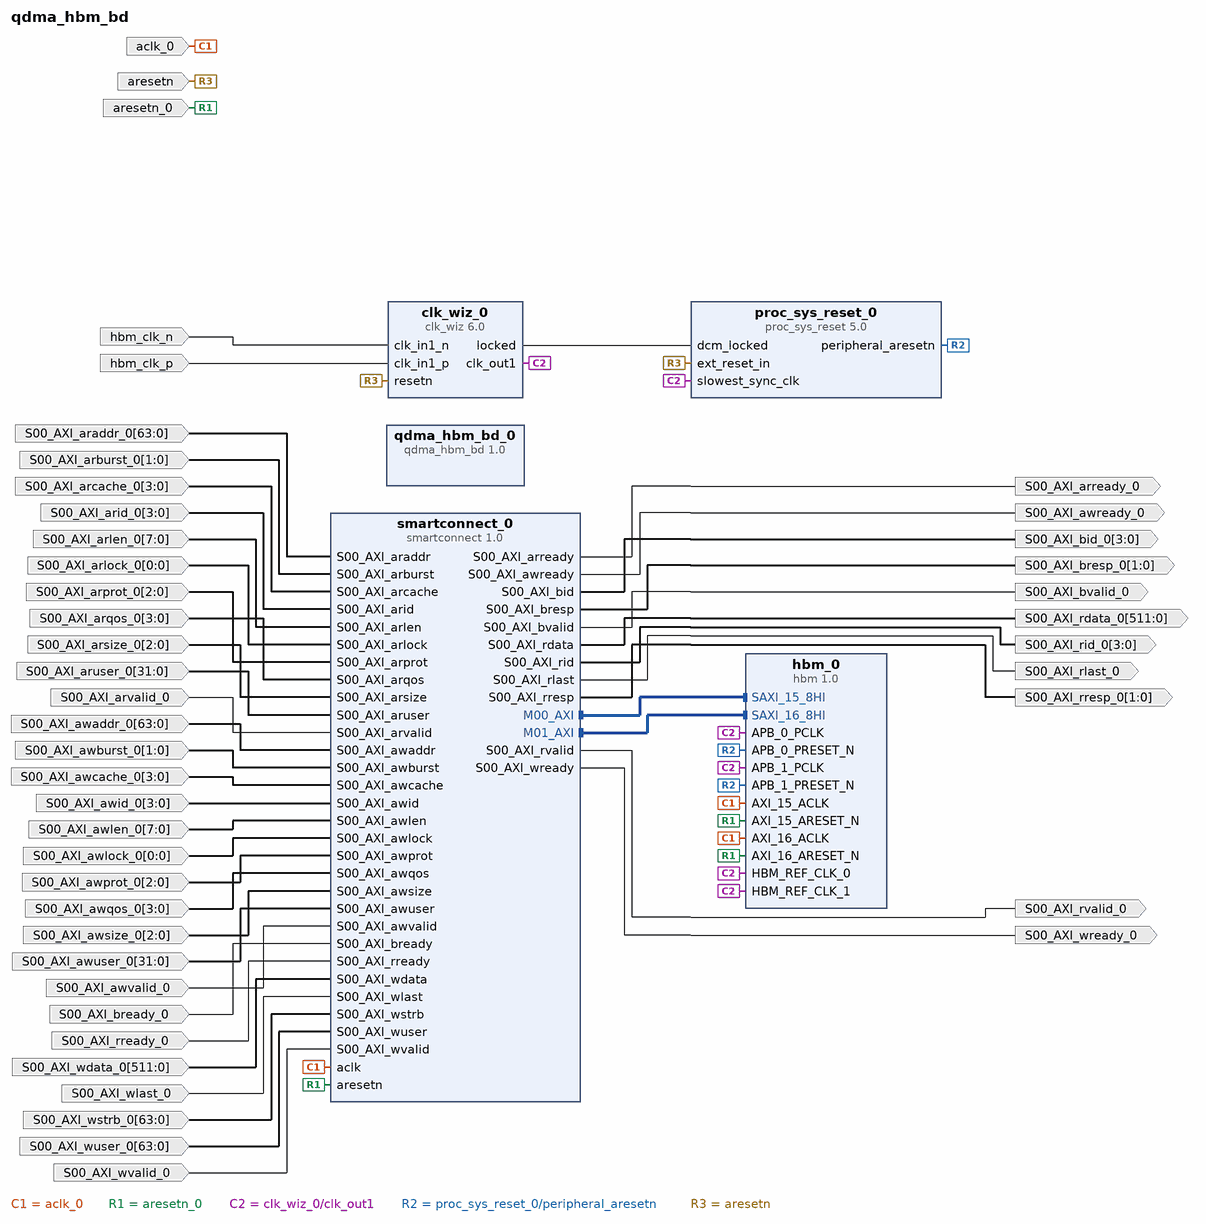
[diagram p0: block diagram of the top level]
# Vivado block design qdma_hbm_bd, xcu55c-fsvh2892-2L-e, Vivado 2024.2
create_bd_design qdma_hbm_bd

create_bd_port -dir I -type clk hbm_clk_n
set_property -dict {CONFIG.FREQ_HZ 100000000} [get_bd_ports hbm_clk_n]
create_bd_port -dir I -type clk hbm_clk_p
set_property -dict {CONFIG.FREQ_HZ 100000000} [get_bd_ports hbm_clk_p]
create_bd_port -dir I -type rst aresetn
create_bd_port -dir I -type clk aclk_0
set_property -dict {CONFIG.FREQ_HZ 250000000} [get_bd_ports aclk_0]
create_bd_port -dir I -type rst aresetn_0
create_bd_port -dir I -from 3 -to 0 S00_AXI_awid_0
create_bd_port -dir I -from 63 -to 0 S00_AXI_awaddr_0
create_bd_port -dir I -from 7 -to 0 S00_AXI_awlen_0
create_bd_port -dir I -from 2 -to 0 S00_AXI_awsize_0
create_bd_port -dir I -from 1 -to 0 S00_AXI_awburst_0
create_bd_port -dir I -from 0 -to 0 S00_AXI_awlock_0
create_bd_port -dir I -from 3 -to 0 S00_AXI_awcache_0
create_bd_port -dir I -from 2 -to 0 S00_AXI_awprot_0
create_bd_port -dir I -from 3 -to 0 S00_AXI_awqos_0
create_bd_port -dir I -from 31 -to 0 S00_AXI_awuser_0
create_bd_port -dir I S00_AXI_awvalid_0
create_bd_port -dir O S00_AXI_awready_0
create_bd_port -dir I -from 511 -to 0 S00_AXI_wdata_0
create_bd_port -dir I -from 63 -to 0 S00_AXI_wstrb_0
create_bd_port -dir I S00_AXI_wlast_0
create_bd_port -dir I -from 63 -to 0 S00_AXI_wuser_0
create_bd_port -dir I S00_AXI_wvalid_0
create_bd_port -dir O S00_AXI_wready_0
create_bd_port -dir O -from 3 -to 0 S00_AXI_bid_0
create_bd_port -dir O -from 1 -to 0 S00_AXI_bresp_0
create_bd_port -dir O S00_AXI_bvalid_0
create_bd_port -dir I S00_AXI_bready_0
create_bd_port -dir I -from 3 -to 0 S00_AXI_arid_0
create_bd_port -dir I -from 63 -to 0 S00_AXI_araddr_0
create_bd_port -dir I -from 7 -to 0 S00_AXI_arlen_0
create_bd_port -dir I -from 2 -to 0 S00_AXI_arsize_0
create_bd_port -dir I -from 1 -to 0 S00_AXI_arburst_0
create_bd_port -dir I -from 0 -to 0 S00_AXI_arlock_0
create_bd_port -dir I -from 3 -to 0 S00_AXI_arcache_0
create_bd_port -dir I -from 2 -to 0 S00_AXI_arprot_0
create_bd_port -dir I -from 3 -to 0 S00_AXI_arqos_0
create_bd_port -dir I -from 31 -to 0 S00_AXI_aruser_0
create_bd_port -dir I S00_AXI_arvalid_0
create_bd_port -dir O S00_AXI_arready_0
create_bd_port -dir O -from 3 -to 0 S00_AXI_rid_0
create_bd_port -dir O -from 511 -to 0 S00_AXI_rdata_0
create_bd_port -dir O -from 1 -to 0 S00_AXI_rresp_0
create_bd_port -dir O S00_AXI_rlast_0
create_bd_port -dir O S00_AXI_rvalid_0
create_bd_port -dir I S00_AXI_rready_0

create_bd_cell -type ip -vlnv xilinx.com:ip:hbm:1.0 hbm_0
set_property -dict [list \
  CONFIG.USER_APB_EN false \
  CONFIG.USER_AXI_INPUT_CLK1_FREQ 250 \
  CONFIG.USER_AXI_INPUT_CLK_FREQ 250 \
  CONFIG.USER_HBM_DENSITY 16GB \
  CONFIG.USER_MC0_USER_PARITY_EN false \
  CONFIG.USER_SAXI_00 false \
  CONFIG.USER_SAXI_01 false \
  CONFIG.USER_SAXI_02 false \
  CONFIG.USER_SAXI_03 false \
  CONFIG.USER_SAXI_04 false \
  CONFIG.USER_SAXI_05 false \
  CONFIG.USER_SAXI_06 false \
  CONFIG.USER_SAXI_07 false \
  CONFIG.USER_SAXI_08 false \
  CONFIG.USER_SAXI_09 false \
  CONFIG.USER_SAXI_10 false \
  CONFIG.USER_SAXI_11 false \
  CONFIG.USER_SAXI_12 false \
  CONFIG.USER_SAXI_13 false \
  CONFIG.USER_SAXI_14 false \
  CONFIG.USER_SAXI_17 false \
  CONFIG.USER_SAXI_18 false \
  CONFIG.USER_SAXI_19 false \
  CONFIG.USER_SAXI_20 false \
  CONFIG.USER_SAXI_21 false \
  CONFIG.USER_SAXI_22 false \
  CONFIG.USER_SAXI_23 false \
  CONFIG.USER_SAXI_24 false \
  CONFIG.USER_SAXI_25 false \
  CONFIG.USER_SAXI_26 false \
  CONFIG.USER_SAXI_27 false \
  CONFIG.USER_SAXI_28 false \
  CONFIG.USER_SAXI_29 false \
  CONFIG.USER_SAXI_30 false \
  CONFIG.USER_SAXI_31 false \
] [get_bd_cells hbm_0]
create_bd_cell -type ip -vlnv xilinx.com:ip:smartconnect:1.0 smartconnect_0
set_property -dict {CONFIG.NUM_MI 2 CONFIG.NUM_SI 1} [get_bd_cells smartconnect_0]
create_bd_cell -type ip -vlnv xilinx.com:ip:clk_wiz:6.0 clk_wiz_0
set_property -dict [list \
  CONFIG.PRIM_SOURCE Differential_clock_capable_pin \
  CONFIG.RESET_PORT resetn \
  CONFIG.RESET_TYPE ACTIVE_LOW \
] [get_bd_cells clk_wiz_0]
create_bd_cell -type ip -vlnv xilinx.com:ip:proc_sys_reset:5.0 proc_sys_reset_0
create_bd_cell -type ip -vlnv user.org:user:qdma_hbm_bd:1.0 qdma_hbm_bd_0

# ---- connections ----

connect_bd_intf_net [get_bd_intf_pins smartconnect_0/M00_AXI] [get_bd_intf_pins hbm_0/SAXI_15_8HI]
connect_bd_intf_net [get_bd_intf_pins smartconnect_0/M01_AXI] [get_bd_intf_pins hbm_0/SAXI_16_8HI]
connect_bd_net -net S00_AXI_araddr_0_1 [get_bd_ports S00_AXI_araddr_0] [get_bd_pins smartconnect_0/S00_AXI_araddr]
connect_bd_net -net S00_AXI_arburst_0_1 [get_bd_ports S00_AXI_arburst_0] [get_bd_pins smartconnect_0/S00_AXI_arburst]
connect_bd_net -net S00_AXI_arcache_0_1 [get_bd_ports S00_AXI_arcache_0] [get_bd_pins smartconnect_0/S00_AXI_arcache]
connect_bd_net -net S00_AXI_arid_0_1 [get_bd_ports S00_AXI_arid_0] [get_bd_pins smartconnect_0/S00_AXI_arid]
connect_bd_net -net S00_AXI_arlen_0_1 [get_bd_ports S00_AXI_arlen_0] [get_bd_pins smartconnect_0/S00_AXI_arlen]
connect_bd_net -net S00_AXI_arlock_0_1 [get_bd_ports S00_AXI_arlock_0] [get_bd_pins smartconnect_0/S00_AXI_arlock]
connect_bd_net -net S00_AXI_arprot_0_1 [get_bd_ports S00_AXI_arprot_0] [get_bd_pins smartconnect_0/S00_AXI_arprot]
connect_bd_net -net S00_AXI_arqos_0_1 [get_bd_ports S00_AXI_arqos_0] [get_bd_pins smartconnect_0/S00_AXI_arqos]
connect_bd_net -net S00_AXI_arsize_0_1 [get_bd_ports S00_AXI_arsize_0] [get_bd_pins smartconnect_0/S00_AXI_arsize]
connect_bd_net -net S00_AXI_aruser_0_1 [get_bd_ports S00_AXI_aruser_0] [get_bd_pins smartconnect_0/S00_AXI_aruser]
connect_bd_net -net S00_AXI_arvalid_0_1 [get_bd_ports S00_AXI_arvalid_0] [get_bd_pins smartconnect_0/S00_AXI_arvalid]
connect_bd_net -net S00_AXI_awaddr_0_1 [get_bd_ports S00_AXI_awaddr_0] [get_bd_pins smartconnect_0/S00_AXI_awaddr]
connect_bd_net -net S00_AXI_awburst_0_1 [get_bd_ports S00_AXI_awburst_0] [get_bd_pins smartconnect_0/S00_AXI_awburst]
connect_bd_net -net S00_AXI_awcache_0_1 [get_bd_ports S00_AXI_awcache_0] [get_bd_pins smartconnect_0/S00_AXI_awcache]
connect_bd_net -net S00_AXI_awid_0_1 [get_bd_ports S00_AXI_awid_0] [get_bd_pins smartconnect_0/S00_AXI_awid]
connect_bd_net -net S00_AXI_awlen_0_1 [get_bd_ports S00_AXI_awlen_0] [get_bd_pins smartconnect_0/S00_AXI_awlen]
connect_bd_net -net S00_AXI_awlock_0_1 [get_bd_ports S00_AXI_awlock_0] [get_bd_pins smartconnect_0/S00_AXI_awlock]
connect_bd_net -net S00_AXI_awprot_0_1 [get_bd_ports S00_AXI_awprot_0] [get_bd_pins smartconnect_0/S00_AXI_awprot]
connect_bd_net -net S00_AXI_awqos_0_1 [get_bd_ports S00_AXI_awqos_0] [get_bd_pins smartconnect_0/S00_AXI_awqos]
connect_bd_net -net S00_AXI_awsize_0_1 [get_bd_ports S00_AXI_awsize_0] [get_bd_pins smartconnect_0/S00_AXI_awsize]
connect_bd_net -net S00_AXI_awuser_0_1 [get_bd_ports S00_AXI_awuser_0] [get_bd_pins smartconnect_0/S00_AXI_awuser]
connect_bd_net -net S00_AXI_awvalid_0_1 [get_bd_ports S00_AXI_awvalid_0] [get_bd_pins smartconnect_0/S00_AXI_awvalid]
connect_bd_net -net S00_AXI_bready_0_1 [get_bd_ports S00_AXI_bready_0] [get_bd_pins smartconnect_0/S00_AXI_bready]
connect_bd_net -net S00_AXI_rready_0_1 [get_bd_ports S00_AXI_rready_0] [get_bd_pins smartconnect_0/S00_AXI_rready]
connect_bd_net -net S00_AXI_wdata_0_1 [get_bd_ports S00_AXI_wdata_0] [get_bd_pins smartconnect_0/S00_AXI_wdata]
connect_bd_net -net S00_AXI_wlast_0_1 [get_bd_ports S00_AXI_wlast_0] [get_bd_pins smartconnect_0/S00_AXI_wlast]
connect_bd_net -net S00_AXI_wstrb_0_1 [get_bd_ports S00_AXI_wstrb_0] [get_bd_pins smartconnect_0/S00_AXI_wstrb]
connect_bd_net -net S00_AXI_wuser_0_1 [get_bd_ports S00_AXI_wuser_0] [get_bd_pins smartconnect_0/S00_AXI_wuser]
connect_bd_net -net S00_AXI_wvalid_0_1 [get_bd_ports S00_AXI_wvalid_0] [get_bd_pins smartconnect_0/S00_AXI_wvalid]
connect_bd_net -net aclk_0_1 [get_bd_ports aclk_0] [get_bd_pins smartconnect_0/aclk] [get_bd_pins hbm_0/AXI_15_ACLK] [get_bd_pins hbm_0/AXI_16_ACLK]
connect_bd_net -net aclk_n_1 [get_bd_ports hbm_clk_n] [get_bd_pins clk_wiz_0/clk_in1_n]
connect_bd_net -net aclk_p_1 [get_bd_ports hbm_clk_p] [get_bd_pins clk_wiz_0/clk_in1_p]
connect_bd_net -net aresetn_0_1 [get_bd_ports aresetn_0] \
  [get_bd_pins smartconnect_0/aresetn] [get_bd_pins hbm_0/AXI_15_ARESET_N] [get_bd_pins hbm_0/AXI_16_ARESET_N]
connect_bd_net [get_bd_pins clk_wiz_0/clk_out1] \
  [get_bd_pins hbm_0/HBM_REF_CLK_0] [get_bd_pins hbm_0/HBM_REF_CLK_1] [get_bd_pins hbm_0/APB_0_PCLK] \
  [get_bd_pins hbm_0/APB_1_PCLK] [get_bd_pins proc_sys_reset_0/slowest_sync_clk]
connect_bd_net [get_bd_pins clk_wiz_0/locked] [get_bd_pins proc_sys_reset_0/dcm_locked]
connect_bd_net [get_bd_pins proc_sys_reset_0/peripheral_aresetn] [get_bd_pins hbm_0/APB_0_PRESET_N] [get_bd_pins hbm_0/APB_1_PRESET_N]
connect_bd_net -net resetn_0_1 [get_bd_ports aresetn] [get_bd_pins proc_sys_reset_0/ext_reset_in] [get_bd_pins clk_wiz_0/resetn]
connect_bd_net [get_bd_pins smartconnect_0/S00_AXI_arready] [get_bd_ports S00_AXI_arready_0]
connect_bd_net [get_bd_pins smartconnect_0/S00_AXI_awready] [get_bd_ports S00_AXI_awready_0]
connect_bd_net [get_bd_pins smartconnect_0/S00_AXI_bid] [get_bd_ports S00_AXI_bid_0]
connect_bd_net [get_bd_pins smartconnect_0/S00_AXI_bresp] [get_bd_ports S00_AXI_bresp_0]
connect_bd_net [get_bd_pins smartconnect_0/S00_AXI_bvalid] [get_bd_ports S00_AXI_bvalid_0]
connect_bd_net [get_bd_pins smartconnect_0/S00_AXI_rdata] [get_bd_ports S00_AXI_rdata_0]
connect_bd_net [get_bd_pins smartconnect_0/S00_AXI_rid] [get_bd_ports S00_AXI_rid_0]
connect_bd_net [get_bd_pins smartconnect_0/S00_AXI_rlast] [get_bd_ports S00_AXI_rlast_0]
connect_bd_net [get_bd_pins smartconnect_0/S00_AXI_rresp] [get_bd_ports S00_AXI_rresp_0]
connect_bd_net [get_bd_pins smartconnect_0/S00_AXI_rvalid] [get_bd_ports S00_AXI_rvalid_0]
connect_bd_net [get_bd_pins smartconnect_0/S00_AXI_wready] [get_bd_ports S00_AXI_wready_0]

validate_bd_design
save_bd_design
